# Altium schematic sheet BTN7971B.SchDoc
size 292 x 193 mm; Author: Power Lin; SheetNumber: 1; SheetTotal: 1; Website: wiki-power.com
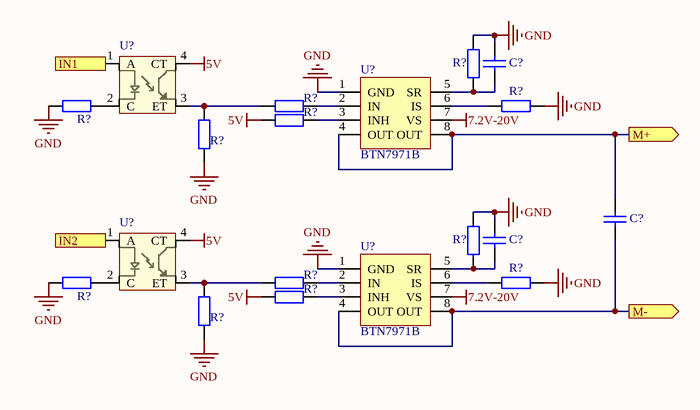
[diagram p0: BTN7971B.SchDoc]

## Parts
(Parts that share a designator on the sheet are numbered #1, #2 ... from top to bottom, then left to right.)
C?#1  100nF  [CAP-0603]  (value not drawn)
C?#2  22pF  [CAP-0603]  (value not drawn)
C?#3  100nF  [CAP-0603]  (value not drawn)
R?#1  1K  [R-0603]  (value not drawn)
R?#2  1K  [R-0603]  (value not drawn)
R?#3  10K  [R-0603]  (value not drawn)
R?#4  2K  [R-0603]  (value not drawn)
R?#5  10K  [R-0603]  (value not drawn)
R?#6  2K  [R-0603]  (value not drawn)
R?#7  1K  [R-0603]  (value not drawn)
R?#8  1K  [R-0603]  (value not drawn)
R?#9  10K  [R-0603]  (value not drawn)
R?#10  2K  [R-0603]  (value not drawn)
R?#11  10K  [R-0603]  (value not drawn)
R?#12  2K  [R-0603]  (value not drawn)
U?#1  EL2501  (value not drawn)
U?#2  BTN7971B  [TO-263-7]
U?#3  EL2501  (value not drawn)
U?#4  BTN7971B  [TO-263-7]

## Ports
IN1 (in), IN2 (in), M+ (out), M- (out)

## Nets
5V: R?#5.1 R?#11.1 U?#1.4(CT) U?#3.4(CT)
7.2V-20V: U?#2.7(VS) U?#4.7(VS)
GND: C?#1.2 C?#3.2 R?#1.2 R?#2.1 R?#4.1 R?#6.1 R?#7.2 R?#8.1 R?#10.1 R?#12.1 U?#2.1(GND) U?#4.1(GND)
IN1: U?#1.1(A) ; port IN1
IN2: U?#3.1(A) ; port IN2
M+: C?#2.2 U?#2.4(OUT) U?#2.8(OUT) ; port M+
M-: C?#2.1 U?#4.4(OUT) U?#4.8(OUT) ; port M-
NetC?#1_1: C?#1.1 R?#1.1 U?#2.5(SR)
NetC?#3_1: C?#3.1 R?#7.1 U?#4.5(SR)
NetR?#2_2: R?#2.2 U?#1.2(C)
NetR?#3_1: R?#3.1 R?#6.2 U?#1.3(ET)
NetR?#3_2: R?#3.2 U?#2.2(IN)
NetR?#4_2: R?#4.2 U?#2.6(IS)
NetR?#5_2: R?#5.2 U?#2.3(INH)
NetR?#8_2: R?#8.2 U?#3.2(C)
NetR?#9_1: R?#9.1 R?#12.2 U?#3.3(ET)
NetR?#9_2: R?#9.2 U?#4.2(IN)
NetR?#10_2: R?#10.2 U?#4.6(IS)
NetR?#11_2: R?#11.2 U?#4.3(INH)

## Notes on the sheet
- Author
- DocumentName
- ModifiedDate
- ProjectName
- SheetNumber
- SheetTotal
- Website
- Revision

## Library data of the parts
C?#1-C?#3 = CAP: 贴片电容; ComponentLink1Description: 供应商链接; ComponentLink1URL: http://www.szlcsc.com/product/details_53938.html; Package: 0402; Supplier: LC; SuppliersPartNumber: C52923
R?#1-R?#12 = RES: 贴片电阻; Package: 0805; Supplier: LC; SuppliersPartNumber: C17798
U?#1 U?#3 = EL2501: 光耦; MF: Everlight Electronics; MP: EL817S1_A__TU_-V; Package: SMD-4 Everlight Electronics; Price: None; Availability: Unavailable; SnapEDA_Link: https://www.snapeda.com/parts/EL817S1%28A%29%28TU%29-V/Everlight%20Electronics%20Co%20Ltd/view-part/?ref=snap; Value: *
U?#2 U?#4 = BTN7971B: 半桥 MOS